# Altium schematic sheet 16-channel-EEG-SCH.SchDoc: 16 CHANNEL EEG MONITOR
size 431 x 279 mm; ApprovedBy: NA; CheckedBy: NA; Author: ANDY NGUYEN; CompanyName: NA; DrawnBy: ANDY NGUYEN; Engineer: ANDY NGUYEN; Organization: NA; DocumentNumber: NA; Revision: 1; Title2: NA; ENG_APP_DATE: --/--/--; DSN_APP_DATE: --/--/--; CHK_APP_DATE: --/--/--
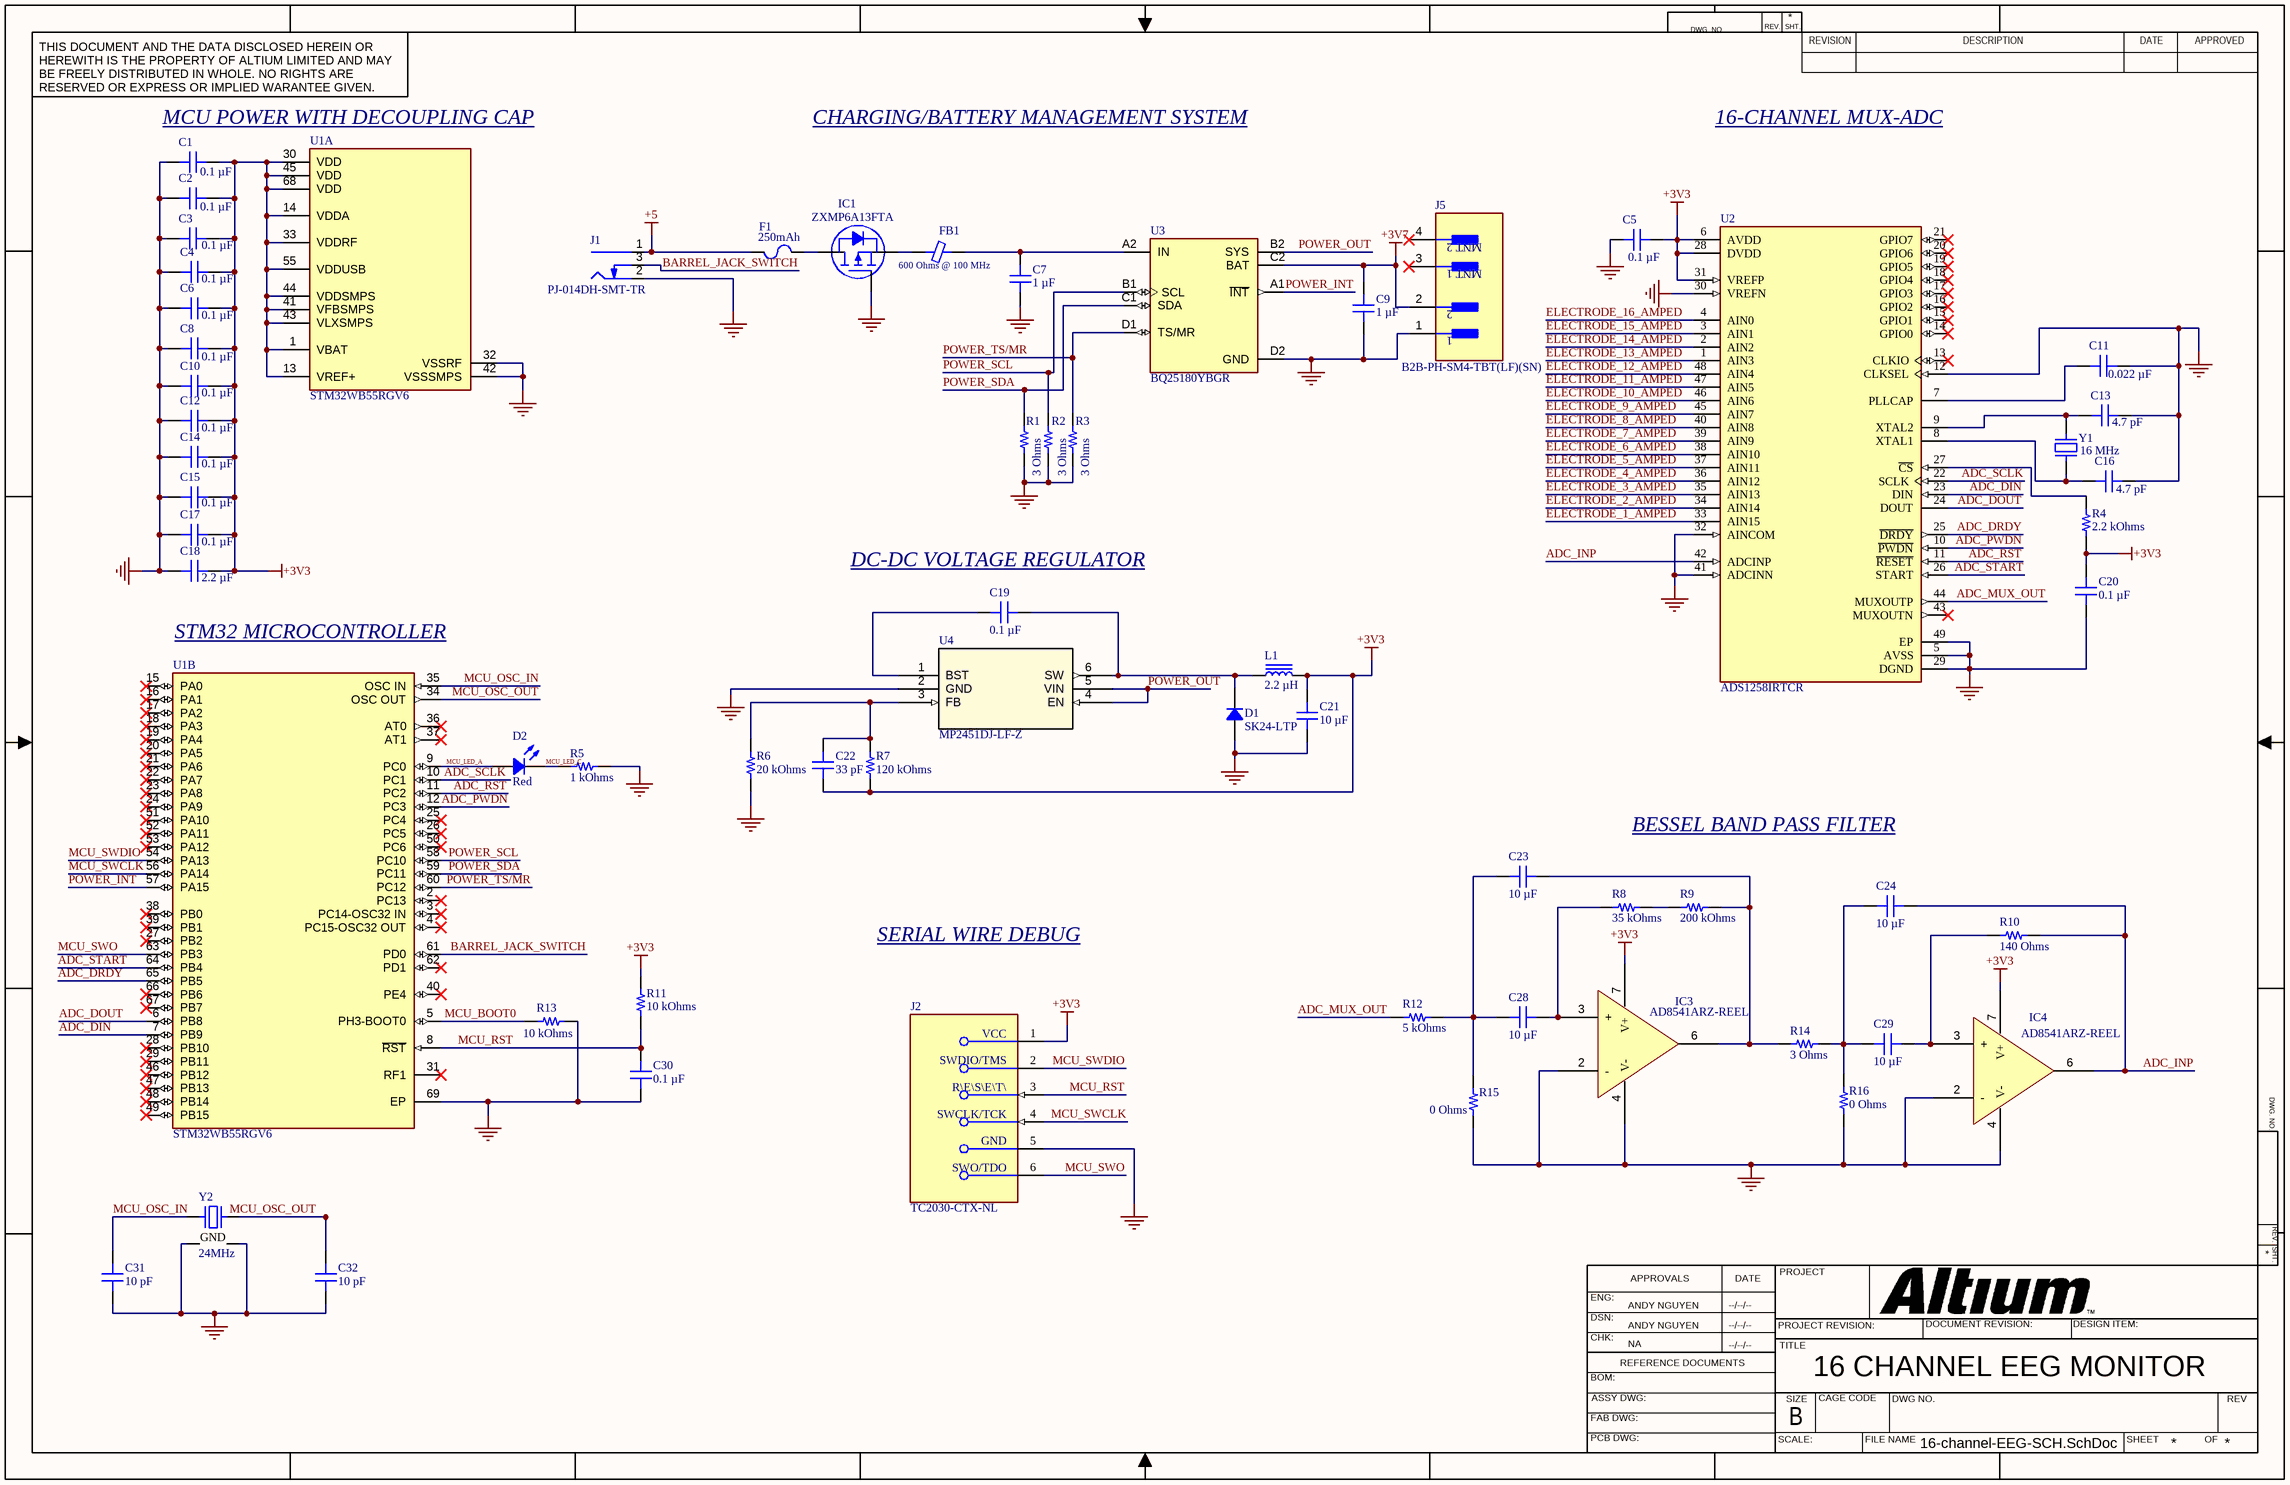
[diagram p0: 16-channel-EEG-SCH.SchDoc]

## Parts
C1  0.1 µF  [CAP 0402_1005]
C2  0.1 µF  [CAP 0402_1005]
C3  0.1 µF  [CAP 0402_1005]
C4  0.1 µF  [CAP 0402_1005]
C5  0.1 µF  [CAP 0402_1005]
C6  0.1 µF  [CAP 0402_1005]
C7  1 µF  [CAP 0402_1005]
C8  0.1 µF  [CAP 0402_1005]
C9  1 µF  [CAP 0402_1005]
C10  0.1 µF  [CAP 0402_1005]
C11  0.022 µF  [CAP 0402_1005]
C12  0.1 µF  [CAP 0402_1005]
C13  4.7 pF  [CAP 0402_1005]
C14  0.1 µF  [CAP 0402_1005]
C15  0.1 µF  [CAP 0402_1005]
C16  4.7 pF  [CAP 0402_1005]
C17  0.1 µF  [CAP 0402_1005]
C18  2.2 µF  [CAP 0603_1608]
C19  0.1 µF  [CAP 0402_1005]
C20  0.1 µF  [CAP 0402_1005]
C21  10 µF  [CAP 0402_1005]
C22  33 pF  [CAP 0402_1005]
C23  10 µF  [CAP 0402_1005]
C24  10 µF  [CAP 0402_1005]
C28  10 µF  [CAP 0402_1005]
C29  10 µF  [CAP 0402_1005]
C30  0.1 µF  [CAP 0402_1005]
C31  10 pF  [CAP 0402_1005]
C32  10 pF  [CAP 0402_1005]
D1  SK24-LTP  [DO214AA SMB]
D2  Red  [LED 1206_3216 RED]
F1  250mAh  [FUSE 1206_3216 0.6MM]
FB1  600 Ohms @ 100 MHz  [FER 0805_2012]
IC1  ZXMP6A13FTA  [DIODES SOT-23-3]
IC3  AD8541ARZ-REEL  [ANALOG DEV SOIC-8 R8]
IC4  AD8541ARZ-REEL  [ANALOG DEV SOIC-8 R8]
J1  PJ-014DH-SMT-TR  [CUI PJ-014DH-SMT]
J2  TC2030-CTX-NL  [FP-TC2030-CTX-NL-MFG]
J5  B2B-PH-SM4-TBT(LF)(SN)  [FP-B2B-PH-SM4-TBT_LF_SN-MFG]
L1  2.2 µH  [BOURNS SRP5030T]
R1  3 Ohms  [RES 0402_1005]
R2  3 Ohms  [RES 0402_1005]
R3  3 Ohms  [RES 0402_1005]
R4  2.2 kOhms  [RES 0402_1005]
R5  1 kOhms  [RES 0402_1005]
R6  20 kOhms  [RES 0402_1005]
R7  120 kOhms  [RES 0402_1005]
R8  35 kOhms  [RES 0402_1005]
R9  200 kOhms  [RES 0402_1005]
R10  140 Ohms  [RES 0402_1005]
R11  10 kOhms  [RES 0402_1005]
R12  5 kOhms  [RES 0402_1005]
R13  10 kOhms  [RES 0402_1005]
R14  3 Ohms  [RES 0402_1005]
R15  0 Ohms  [RES 0402_1005]
R16  0 Ohms  [RES 0402_1005]
U1  STM32WB55RGV6  [FP-VFQFPN-68-B029-MFG]  (parts A,B of 2)
U2  ADS1258IRTCR  [FP-RTC0048A-IPC_C]
U3  BQ25180YBGR  [IC_BQ25180YBGR]
U4  MP2451DJ-LF-Z  [TSOT23-6_MP2451_MNP]
Y1  16 MHz  [ABRACON ABLS]
Y2  24MHz  [ABRACON ABM8G]

## Nets
+3V3: C1.1 C2.1 C3.1 C4.1 C5.2 C6.1 C8.1 C10.1 C12.1 C14.1 C15.1 C17.1 C18.1 C20.2 C21.2 C22.1 IC3.7(V+) IC4.7(V+) J2.1(VCC) L1.2 R4.1 R7.1 R11.2 U1.1(VBAT) U1.13(VREF+) U1.14(VDDA) U1.30(VDD) U1.33(VDDRF) U1.41(VFBSMPS) U1.43(VLXSMPS) U1.44(VDDSMPS) U1.45(VDD) U1.55(VDDUSB) U1.68(VDD) U2.6(AVDD) U2.28(DVDD) U2.31(VREFP)
+3V7: C9.2 J5.2 U3.C2(BAT)
+5: F1.1 J1.1(Centre)
GND: C1.2 C2.2 C3.2 C4.2 C5.1 C6.2 C7.1 C8.2 C9.1 C10.2 C11.2 C12.2 C13.2 C14.2 C15.2 C16.2 C17.2 C18.2 C20.1 C21.1 C30.1 C31.1 C32.1 D1.1 IC1.1(G) IC3.2(-) IC3.4(V-) IC4.2(-) IC4.4(V-) J1.2(Outer) J2.5(GND) J5.1 R1.1 R2.1 R3.1 R5.1 R6.1 R13.1 R15.1 R16.1 U1.32(VSSRF) U1.42(VSSSMPS) U1.69(EP) U2.5(AVSS) U2.12(CLKSEL) U2.29(DGND) U2.30(VREFN) U2.32(AINCOM) U2.41(ADCINN) U2.49(EP) U3.D2(GND) U4.2(GND) Y2.2(GND) Y2.4(GND)
ADC_DIN: U1.7(PB9) U2.23(DIN)
ADC_DOUT: U1.6(PB8) U2.24(DOUT)
ADC_DRDY: U1.65(PB5) U2.25(~{DRDY})
ADC_INP: C24.2 IC4.6(OUT) R10.2 U2.42(ADCINP)
ADC_MUX_OUT: R12.1 U2.44(MUXOUTP)
ADC_PWDN: U1.12(PC3) U2.10(~{PWDN})
ADC_RST: U1.11(PC2) U2.11(~{RESET})
ADC_SCLK: U1.10(PC1) U2.22(SCLK)
ADC_START: U1.64(PB4) U2.26(START)
BARREL_JACK_SWITCH: J1.3(SW) U1.61(PD0)
ELECTRODE_1_AMPED: U2.33(AIN15)
ELECTRODE_2_AMPED: U2.34(AIN14)
ELECTRODE_3_AMPED: U2.35(AIN13)
ELECTRODE_4_AMPED: U2.36(AIN12)
ELECTRODE_5_AMPED: U2.37(AIN11)
ELECTRODE_6_AMPED: U2.38(AIN10)
ELECTRODE_7_AMPED: U2.39(AIN9)
ELECTRODE_8_AMPED: U2.40(AIN8)
ELECTRODE_9_AMPED: U2.45(AIN7)
ELECTRODE_10_AMPED: U2.46(AIN6)
ELECTRODE_11_AMPED: U2.47(AIN5)
ELECTRODE_12_AMPED: U2.48(AIN4)
ELECTRODE_13_AMPED: U2.1(AIN3)
ELECTRODE_14_AMPED: U2.2(AIN2)
ELECTRODE_15_AMPED: U2.3(AIN1)
ELECTRODE_16_AMPED: U2.4(AIN0)
MCU_BOOT0: R13.2 U1.5(PH3-BOOT0)
MCU_LED_A: D2.1 U1.9(PC0)
MCU_LED_C: D2.2 R5.2
MCU_OSC_IN: C31.2 U1.35(OSC_IN) Y2.1
MCU_OSC_OUT: C32.2 U1.34(OSC_OUT) Y2.3
MCU_RST: C30.2 J2.3(~{RESET}) R11.1 U1.8(~{RST})
MCU_SWCLK: J2.4(SWCLK/TCK) U1.56(PA14)
MCU_SWDIO: J2.2(SWDIO/TMS) U1.54(PA13)
MCU_SWO: J2.6(SWO/TDO) U1.63(PB3)
POWER_INT: U1.57(PA15) U3.A1(~{INT})
POWER_OUT: U3.B2(SYS) U4.4(EN) U4.5(VIN)
POWER_SCL: R2.2 U1.58(PC10) U3.B1(SCL)
POWER_SDA: R1.2 U1.59(PC11) U3.C1(SDA)
POWER_TS/MR: R3.2 U1.60(PC12) U3.D1(TS/MR)
NetC7_2: C7.2 FB1.2 U3.A2(IN)
NetC11_1: C11.1 U2.7(PLLCAP)
NetC13_1: C13.1 U2.9(XTAL2) Y1.2
NetC16_1: C16.1 U2.8(XTAL1) Y1.1
NetC19_1: C19.1 U4.1(BST)
NetC19_2: C19.2 D1.2 L1.1 U4.6(SW)
NetC22_2: C22.2 R6.2 R7.2 U4.3(FB)
NetC23_1: C23.1 C28.1 R12.2 R15.2
NetC23_2: C23.2 IC3.6(OUT) R9.2 R14.1
NetC24_1: C24.1 C29.1 R14.2 R16.2
NetC28_2: C28.2 IC3.3(+) R8.1
NetC29_2: C29.2 IC4.3(+) R10.1
NetF1_2: F1.2 IC1.3(D)
NetFB1_1: FB1.1 IC1.2(S)
NetR4_2: R4.2 U2.27(~{CS})
NetR8_2: R8.2 R9.1

Not connected (* = marked no-connect by the designer): J5 3(MNT_1)* 4(MNT_2)*; U1 2(PC13)* 3(PC14-OSC32_IN)* 4(PC15-OSC32_OUT)* 15(PA0)* 16(PA1)* 17(PA2)* 18(PA3)* 19(PA4)* 20(PA5)* 21(PA6)* 22(PA7)* 23(PA8)* 24(PA9)* 25(PC4)* 26(PC5)* 27(PB2)* 28(PB10)* 29(PB11)* 31(RF1)* 36(AT0)* 37(AT1)* 38(PB0)* 39(PB1)* 40(PE4)* 46(PB12)* 47(PB13)* 48(PB14)* 49(PB15)* 50(PC6)* 51(PA10)* 52(PA11)* 53(PA12)* 62(PD1)* 66(PB6)* 67(PB7)*; U2 13(CLKIO)* 14(GPIO0)* 15(GPIO1)* 16(GPIO2)* 17(GPIO3)* 18(GPIO4)* 19(GPIO5)* 20(GPIO6)* 21(GPIO7)* 43(MUXOUTN)*

## Notes on the sheet
- MCU POWER WITH DECOUPLING CAP
- CHARGING/BATTERY MANAGEMENT SYSTEM
- 16-CHANNEL MUX-ADC
- (near C19) DC-DC VOLTAGE REGULATOR
- STM32 MICROCONTROLLER
- BESSEL BAND PASS FILTER
- SERIAL WIRE DEBUG
- DWG. NO.
- REV.
- SHT.
- THIS DOCUMENT AND THE DATA DISCLOSED HEREIN OR HEREWITH IS THE PROPERTY OF ALTIUM LIMITED AND MAY BE FREELY DISTRIBUTED IN WHOLE. NO RIGHTS ARE RESERVED OR EXPRESS OR IMPLIED WARANTEE GIVEN.
- REVISION
- DESCRIPTION
- DATE
- APPROVED
- ENG:
- APPROVALS
- PROJECT
- DSN:
- CHK:
- REFERENCE DOCUMENTS
- PROJECT REVISION:
- TITLE
- DOCUMENT REVISION:
- DESIGN ITEM:
- BOM:
- FAB DWG:
- PCB DWG:
- ASSY DWG:
- SCALE:
- SIZE
- B
- CAGE CODE
- FILE NAME
- DWG NO.
- SHEET
- OF
- REV

## Library data of the parts
C1-C6 C8 C10 C12 C14 C15 C17 C20 = C0402C104K4RECAUTO: CAP CER 0402 0.1UF 16V X7R 10%; manufacturer: KEMET; Part Number: C0402C104K4RECAUTO; Value: 0.1 µF; Applications: Automotive, ESD Protection; Capacitance: 0.1 µF; componentlink1description: Datasheet; componentlink1url: https://api.kemet.com/component-edge/download/datasheet/C0402C104K4RECAUTO.pdf; componentlink2description: DigiKey Link; componentlink2url: https://www.digikey.com/en/products/detail/kemet/C0402C104K4RECAUTO/8563695; Device Package: 0402 (1005 Metric); lastupdated: 1/28/2024 8:04:20 PM; Lifecycle Status: Active; Minimum Order: 1; Mounting Type: Surface Mount, MLCC; Operating Temperature: -55°C ~ 125°C; Package / Case: 0402 (1005 Metric); packaging: TapeAndReel; partid: 1731; Part Status: Active; price: 0.01; Ratings: AEC-Q200; series: ESD SMD Auto X7R; Size / Dimension: 0.039" L x 0.020" W (1.00mm x 0.50mm); Supplier 1: DigiKey; Supplier Part Number 1: 399-17167-1-ND; Temperature Coefficient: X7R; Thickness (Max): 0.022" (0.55mm); Tolerance: ±10%; Voltage - Rated: 16V
C7 C9 = GRM155R6YA105KE11D: CAP CER 1UF 35V X5R 0402; manufacturer: Murata Electronics; Tolerance: ±10%; Part Number: GRM155R6YA105KE11D; Value: 1 µF; Applications: General Purpose; Capacitance: 1 µF; componentlink1description: Datasheet; componentlink1url: https://search.murata.co.jp/Ceramy/image/img/A01X/G101/ENG/GRM155R6YA105KE11-01.pdf; componentlink2description: DigiKey Link; componentlink2url: https://www.digikey.com/en/products/detail/murata-electronics/GRM155R6YA105KE11D/4905162; Device Package: 0402 (1005 Metric); lastupdated: 1/29/2024 8:04:22 PM; Lifecycle Status: Active; Minimum Order: 1; Mounting Type: Surface Mount, MLCC; Operating Temperature: -55°C ~ 85°C; Package / Case: 0402 (1005 Metric); packaging: TapeAndReel; partid: 4167; Part Status: Active; price: 0.01; series: GRM; Size / Dimension: 0.039" L x 0.020" W (1.00mm x 0.50mm); Supplier 1: DigiKey; Supplier Part Number 1: 490-10019-1-ND; Temperature Coefficient: X5R; Thickness (Max): 0.024" (0.60mm); Voltage - Rated: 35V
C11 = C0402C223K4RECAUTO: CAP CER 0402 22NF 16V X7R 10%; manufacturer: KEMET; Part Number: C0402C223K4RECAUTO; Value: 0.022 µF; Applications: Automotive, ESD Protection; Capacitance: 0.022 µF; componentlink1description: Datasheet; componentlink1url: https://api.kemet.com/component-edge/download/datasheet/C0402C223K4RECAUTO.pdf; componentlink2description: DigiKey Link; componentlink2url: https://www.digikey.com/en/products/detail/kemet/C0402C223K4RECAUTO/8640471; Device Package: 0402 (1005 Metric); lastupdated: 1/29/2024 8:04:09 PM; Lifecycle Status: Active; Minimum Order: 1; Mounting Type: Surface Mount, MLCC; Operating Temperature: -55°C ~ 125°C; Package / Case: 0402 (1005 Metric); packaging: TapeAndReel; partid: 12106; Part Status: Active; price: 0.01; Ratings: AEC-Q200; series: ESD SMD Auto X7R; Size / Dimension: 0.039" L x 0.020" W (1.00mm x 0.50mm); Supplier 1: DigiKey; Supplier Part Number 1: 399-17877-1-ND; Temperature Coefficient: X7R; Thickness (Max): 0.022" (0.55mm); Tolerance: ±10%; Voltage - Rated: 16V
C13 C16 = 885012005023: CAP CER 4.7PF 16V C0G/NP0 0402; manufacturer: Würth Elektronik; Temperature Coefficient: C0G, NP0; Tolerance: ±0.5pF; Part Number: 885012005023; Value: 4.7 pF; Applications: General Purpose; Capacitance: 4.7 pF; componentlink1description: Datasheet; componentlink1url: https://katalog.we-online.de/pbs/datasheet/885012005023.pdf; componentlink2description: DigiKey Link; componentlink2url: https://www.digikey.com/en/products/detail/würth-elektronik/885012005023/5453294; Device Package: 0402 (1005 Metric); lastupdated: 1/29/2024 8:04:26 PM; Lifecycle Status: Active; Minimum Order: 1; Mounting Type: Surface Mount, MLCC; Operating Temperature: -55°C ~ 125°C; Package / Case: 0402 (1005 Metric); packaging: TapeAndReel; partid: 2042; Part Status: Active; price: 0.01; series: WCAP-CSGP; Size / Dimension: 0.039" L x 0.020" W (1.00mm x 0.50mm); Supplier 1: DigiKey; Supplier Part Number 1: 732-7439-1-ND; Thickness (Max): 0.022" (0.55mm); Voltage - Rated: 16V
C18 = CC0603ZRY5V7BB225: CAP CER 2.2UF 16V Y5V 0603; manufacturer: Yageo; Temperature Coefficient: Y5V (F); Tolerance: -20%, +80%; Part Number: CC0603ZRY5V7BB225; Value: 2.2 µF; Applications: General Purpose; Capacitance: 2.2 µF; componentlink1description: Datasheet; componentlink1url: http://www.yageo.com/documents/recent/UPY-GPHC_Y5V_6.3V-to-50V_8.pdf; componentlink2description: DigiKey Link; componentlink2url: https://www.digikey.com/en/products/detail/yageo/CC0603ZRY5V7BB225/5883851; Device Package: 0603 (1608 Metric); lastupdated: 1/28/2024 8:09:58 PM; Lifecycle Status: Active; Minimum Order: 1; Mounting Type: Surface Mount, MLCC; Operating Temperature: -30°C ~ 85°C; Package / Case: 0603 (1608 Metric); packaging: TapeAndReel; partid: 2203; Part Status: Active; price: 0.01; series: CC; Size / Dimension: 0.063" L x 0.031" W (1.60mm x 0.80mm); Supplier 1: DigiKey; Supplier Part Number 1: 311-3416-1-ND; Thickness (Max): 0.035" (0.90mm); Voltage - Rated: 16V
C19 = GRM155R62A104ME14D: CAP CER 0.1UF 100V X5R 0402; manufacturer: Murata Electronics; Tolerance: ±20%; Part Number: GRM155R62A104ME14D; Value: 0.1 µF; Applications: General Purpose; Capacitance: 0.1 µF; componentlink1description: Datasheet; componentlink1url: https://search.murata.co.jp/Ceramy/image/img/A01X/G101/ENG/GRM155R62A104ME14-01.pdf; componentlink2description: DigiKey Link; componentlink2url: https://www.digikey.com/en/products/detail/murata-electronics/GRM155R62A104ME14D/5027544; Device Package: 0402 (1005 Metric); lastupdated: 1/29/2024 8:04:24 PM; Lifecycle Status: Active; Minimum Order: 1; Mounting Type: Surface Mount, MLCC; Operating Temperature: -55°C ~ 85°C; Package / Case: 0402 (1005 Metric); packaging: CutTape; partid: 2773; Part Status: Active; price: 0.01; series: GRM; Size / Dimension: 0.039" L x 0.020" W (1.00mm x 0.50mm); Supplier 1: DigiKey; Supplier Part Number 1: 490-10459-1-ND; Temperature Coefficient: X5R; Thickness (Max): 0.022" (0.55mm); Voltage - Rated: 100V
C21 C23 C24 C28 C29 = CL05A106MP5NUNC: CAP CER 10UF 10V X5R 0402; manufacturer: Samsung Electro-Mechanics; Tolerance: ±20%; Part Number: CL05A106MP5NUNC; Value: 10 µF; Applications: General Purpose; Capacitance: 10 µF; componentlink1description: Datasheet; componentlink1url: http://www.samsungsem.com/kr/support/product-search/mlcc/CL05A106MP5NUNC.jsp; componentlink2description: DigiKey Link; componentlink2url: https://www.digikey.com/en/products/detail/samsung-electro-mechanics/CL05A106MP5NUNC/3887108; Device Package: 0402 (1005 Metric); lastupdated: 1/29/2024 8:04:27 PM; Lifecycle Status: Active; Minimum Order: 1; Mounting Type: Surface Mount, MLCC; Operating Temperature: -55°C ~ 85°C; Package / Case: 0402 (1005 Metric); packaging: TapeAndReel; partid: 1762; Part Status: Active; price: 0.02; series: CL; Size / Dimension: 0.039" L x 0.020" W (1.00mm x 0.50mm); Supplier 1: DigiKey; Supplier Part Number 1: 1276-1450-1-ND; Temperature Coefficient: X5R; Thickness (Max): 0.028" (0.70mm); Voltage - Rated: 10V
C22 = UMK105CH330JVHF: CAP CER 33PF 50V CH 0402; manufacturer: Taiyo Yuden; Tolerance: ±5%; Part Number: UMK105CH330JVHF; Value: 33 pF; Applications: Automotive; Capacitance: 33 pF; componentlink2description: DigiKey Link; componentlink2url: https://www.digikey.com/en/products/detail/taiyo-yuden/UMK105CH330JVHF/6563672; Device Package: 0402 (1005 Metric); lastupdated: 1/29/2024 8:04:26 PM; Lifecycle Status: Active; Minimum Order: 1; Mounting Type: Surface Mount, MLCC; Package / Case: 0402 (1005 Metric); packaging: TapeAndReel; partid: 1883; Part Status: Active; price: 0.01; Ratings: AEC-Q200; series: M; Size / Dimension: 0.039" L x 0.020" W (1.00mm x 0.50mm); Supplier 1: DigiKey; Supplier Part Number 1: 587-5079-1-ND; Temperature Coefficient: CH; Voltage - Rated: 50V
C30 = CL05B104KP5VPNC: CAP CER 100NF 10V X7R 0402; manufacturer: Samsung Electro-Mechanics; Tolerance: ±10%; Part Number: CL05B104KP5VPNC; Value: 0.1 µF; Applications: Automotive; Capacitance: 0.1 µF; componentlink1description: Datasheet; componentlink1url: https://mm.digikey.com/Volume0/opasdata/d220001/medias/docus/5458/CL05B104KP5VPNC_Spec.pdf; componentlink2description: DigiKey Link; componentlink2url: https://www.digikey.com/en/products/detail/samsung-electro-mechanics/CL05B104KP5VPNC/20498482; Device Package: 0402 (1005 Metric); lastupdated: 1/25/2024 8:03:07 PM; Lifecycle Status: Active; Minimum Order: 1; Mounting Type: Surface Mount, MLCC; Operating Temperature: -55°C ~ 125°C; Package / Case: 0402 (1005 Metric); packaging: TapeAndReel; partid: 56690; price: 0.01; Ratings: AEC-Q200; series: CL; Size / Dimension: 0.039" L x 0.020" W (1.00mm x 0.50mm); Supplier 1: DigiKey; Supplier Part Number 1: 1276-CL05B104KP5VPNCCT-ND; Temperature Coefficient: X7R; Thickness (Max): 0.022" (0.55mm); Voltage - Rated: 10V
C31 C32 = 885012005025: CAP CER 10PF 16V C0G/NP0 0402; manufacturer: Würth Elektronik; Temperature Coefficient: C0G, NP0; Tolerance: ±5%; Part Number: 885012005025; Value: 10 pF; Applications: General Purpose; Capacitance: 10 pF; componentlink1description: Datasheet; componentlink1url: https://katalog.we-online.de/pbs/datasheet/885012005025.pdf; componentlink2description: DigiKey Link; componentlink2url: https://www.digikey.com/en/products/detail/würth-elektronik/885012005025/5453296; Device Package: 0402 (1005 Metric); lastupdated: 1/25/2024 8:04:27 PM; Lifecycle Status: Active; Minimum Order: 1; Mounting Type: Surface Mount, MLCC; Operating Temperature: -55°C ~ 125°C; Package / Case: 0402 (1005 Metric); packaging: TapeAndReel; partid: 1972; Part Status: Active; price: 0.01; series: WCAP-CSGP; Size / Dimension: 0.039" L x 0.020" W (1.00mm x 0.50mm); Supplier 1: DigiKey; Supplier Part Number 1: 732-7441-1-ND; Thickness (Max): 0.022" (0.55mm); Voltage - Rated: 16V
D1 = SK24-LTP: DIODE SCHOT 40V 2A DO214AA HSMB; Manufacturer: Micro Commercial Co; Capacitance @ Vr, F: 50pF @ 4V, 1MHz; Current - Reverse Leakage @ Vr: 2 mA @ 40 V; Diode Type: Schottky; Speed: Fast Recovery =< 500ns, > 200mA (Io); Voltage - Forward (Vf) (Max) @ If: 500 mV @ 2 A; Part Number: SK24-LTP; ComponentLink1Description: Datasheet; ComponentLink1URL: https://www.mccsemi.com/pdf/Products/SK22-L~SK220-L(DO-214AA).pdf; ComponentLink2Description: DigiKey Link; ComponentLink2URL: https://www.digikey.com/en/products/detail/micro-commercial-co/SK24-LTP/3774982; Current - Average Rectified (Io): 2A; LastUpdated: 9/24/2023 8:18:33 PM; Lifecycle Status: Active; Minimum Order: 1; Mounting Type: Surface Mount; Operating Temperature - Junction: -55°C ~ 125°C; Package / Case: DO-214AA, SMB; Packaging: TapeAndReel; PartId: 1499; Part Status: Active; Price: 0.04; Series: -; Supplier 1: DigiKey; Supplier Part Number 1: SK24-LTPMSCT-ND; Supplier Device Package: DO-214AA, HSMB; Voltage - DC Reverse (Vr) (Max): 40 V
D2 = APTR3216SECK/J3-PRV: LED SMD; Manufacturer: Kingbright; Configuration: 1206; Current - Test: 20mA; Lens Color: Colorless; Lens Size: 1.60mm x 1.40mm; Lens Style: Rectangle with Flat Top; Lens Transparency: Clear; Millicandela Rating: 350mcd; Viewing Angle: 140°; Voltage - Forward (Vf) (Typ): 2.2V; Wavelength - Dominant: 625nm; Wavelength - Peak: 640nm; Part Number: APTR3216SECK/J3-PRV; Color: Red; ComponentLink1Description: Datasheet; ComponentLink1URL: http://www.kingbrightusa.com/images/catalog/SPEC/APTR3216SECK-J3-PRV.pdf; ComponentLink2Description: DigiKey Link; ComponentLink2URL: https://www.digikey.com/en/products/detail/kingbright/APTR3216SECK-J3-PRV/10293085; Device Package: 1206 (3216 Metric); Height (Max): 1.25mm; LastUpdated: 1/26/2024 9:29:21 PM; Lifecycle Status: Active; Minimum Order: 1; Mounting Type: Surface Mount; Package / Case: 1206 (3216 Metric); Packaging: TapeAndReel; PartId: 194; Part Status: Active; Price: 0.17; Series: Heli-R; Size / Dimension: 3.20mm L x 1.60mm W; Supplier 1: DigiKey; Supplier Part Number 1: 754-APTR3216SECK/J3-PRVCT-ND; Supplier Device Package: 1206; Value: Red
F1 = SF-1206FP050-2: FUSE BOARD MNT 500MA 63VDC 1206; Manufacturer: Bourns Inc.; Approval Agency: UL; Breaking Capacity @ Rated Voltage: 50A; Fuse Type: Board Mount (Cartridge Style Excluded); Melting I²t: 0.015; Response Time: Fast Blow; Voltage Rating - DC: 63V; Part Number: SF-1206FP050-2; Approvals: UL; ComponentLink1Description: Datasheet; ComponentLink1URL: https://www.bourns.com/docs/product-datasheets/sf-1206fp.pdf; ComponentLink2Description: DigiKey Link; ComponentLink2URL: http://digikey.com/product-detail/en/bourns-inc/SF-1206FP050-2/SF-1206FP050-2CT-ND/7652265; Current Rating (Amps): 500mA; Device Package: 1206 (3216 Metric); LastUpdated: 9/2/2020 1:30:42 AM; Lifecycle Status: Active; Minimum Order: 1; Mounting Type: Surface Mount; Operating Temperature: -20°C ~ 105°C; Package / Case: 1206 (3216 Metric); Packaging: TapeAndReel; Part Status: Active; Price: 0.34; Series: SinglFuse™ SF-1206FP; Size / Dimension: 0.122" L x 0.061" W x 0.024" H (3.10mm x 1.55mm x 0.60mm); Supplier 1: DigiKey; Supplier Part Number 1: SF-1206FP050-2CT-ND
FB1 = BMB2A0600RS2: FERRITE BEAD 600 OHM 0805 1LN; Manufacturer: TE Connectivity Passive Product; Current Rating (Max): 200mA; DC Resistance (DCR) (Max): 500mOhm; Number of Lines: 1; Part Number: BMB2A0600RS2; ComponentLink1Description: Datasheet; ComponentLink1URL: https://www.te.com/commerce/DocumentDelivery/DDEController?Action=srchrtrv&DocNm=1773184&DocType=DS&DocLang=English; ComponentLink2Description: DigiKey Link; ComponentLink2URL: https://www.digikey.com/en/products/detail/te-connectivity-passive-product/BMB2A0600RS2/1152529; Device Package: 0805 (2012 Metric); Height (Max): 0.043" (1.10mm); Impedance @ Frequency: 600 Ohms @ 100 MHz; LastUpdated: 9/24/2023 8:16:58 PM; Lifecycle Status: Active; Minimum Order: 1; Mounting Type: Surface Mount; Operating Temperature: -55°C ~ 125°C; Package / Case: 0805 (2012 Metric); Packaging: TapeAndReel; PartId: 1506; Part Status: Active; Price: 0.10; Series: BMB-R; Size / Dimension: 0.079" L x 0.047" W (2.00mm x 1.20mm); Supplier 1: DigiKey; Supplier Part Number 1: A102078CT-ND; Value: 600 Ohms @ 100 MHz
IC1 = ZXMP6A13FTA: MOSFET P-CH 60V 900MA SOT23-3; Manufacturer: Diodes Incorporated; Current - Continuous Drain (Id) @ 25°C: 900mA (Ta); Drive Voltage (Max Rds On,  Min Rds On): 4.5V, 10V; FET Type: P-Channel; Gate Charge (Qg) (Max) @ Vgs: 5.9 nC @ 10 V; Input Capacitance (Ciss) (Max) @ Vds: 219 pF @ 30 V; Power Dissipation (Max): 625mW (Ta); Rds On (Max) @ Id, Vgs: 400mOhm @ 900mA, 10V; Vgs (Max): ±20V; Vgs(th) (Max) @ Id: 3V @ 250µA; Part Number: ZXMP6A13FTA; ComponentLink1Description: Datasheet; ComponentLink1URL: https://www.diodes.com/assets/Datasheets/ZXMP6A13F.pdf; ComponentLink2Description: DigiKey Link; ComponentLink2URL: https://www.digikey.com/en/products/detail/diodes-incorporated/ZXMP6A13FTA/560639; Drain to Source Voltage (Vdss): 60 V; LastUpdated: 9/24/2023 8:37:44 PM; Lifecycle Status: Active; Minimum Order: 1; Mounting Type: Surface Mount; Operating Temperature: -55°C ~ 150°C (TJ); Package / Case: TO-236-3, SC-59, SOT-23-3; Packaging: TapeAndReel; Part Status: Active; Price: 0.16; Series: -; Supplier 1: DigiKey; Supplier Part Number 1: ZXMP6A13FCT-ND; Supplier Device Package: SOT-23-3; Technology: MOSFET (Metal Oxide)
IC3 IC4 = AD8541ARZ-REEL: IC OPAMP GP 1 CIRCUIT 8SOIC; Manufacturer: Analog Devices Inc.; Amplifier Type: General Purpose; Current - Input Bias: 4pA; Current - Output / Channel: 30mA; Current - Supply: 45µA; Gain Bandwidth Product: 1MHz; Number of Circuits: 1; Output Type: Rail-to-Rail; Slew Rate: 0.92V/µs; Voltage - Input Offset: 1mV; Voltage - Supply, Single/Dual (±): 2.7V ~ 5.5V; Part Number: AD8541ARZ-REEL; ComponentLink1Description: Datasheet; ComponentLink1URL: https://www.analog.com/media/en/technical-documentation/data-sheets/AD8541_8542_8544.pdf; ComponentLink2Description: DigiKey Link; ComponentLink2URL: http://digikey.com/product-detail/en/analog-devices-inc/AD8541ARZ-REEL/AD8541ARZ-REELCT-ND/4907211; Device Package: 8-SOIC (0.154", 3.90mm Width); LastUpdated: 1/9/2020 12:52:28 AM; Lifecycle Status: Active; Minimum Order: 1; Mounting Type: Surface Mount; Operating Temperature: -40°C ~ 125°C; Package / Case: 8-SOIC (0.154", 3.90mm Width); Packaging: ReReel; PartId: 10; Part Status: Active; Price: 0.00; Series: -; Supplier 1: DigiKey; Supplier Part Number 1: AD8541ARZ-REELCT-ND; Supplier Device Package: 8-SOIC
J1 = PJ-014DH-SMT-TR: CONN PWR JACK 1.3X3.4MM SOLDER; Manufacturer: CUI Devices; Actual Diameter: 0.051" (1.30mm ID), 0.154" (3.90mm OD); Current Rating (Amps): 3.5A; Gender: Male; Industry Recognized Mating Diameter: 1.30mm ID (0.051"), 3.50mm OD (0.138"); Internal Switch(s): Single Switch, Normally Closed; Material Flammability Rating: UL94 V-0; Mating Length/Depth: 0.244" (6.20mm); Number of Positions/Contacts: 2 Conductors, 3 Contacts; Shielding: Unshielded; Voltage - Rated: 24VDC; Part Number: PJ-014DH-SMT-TR; ComponentLink1Description: Datasheet; ComponentLink1URL: https://www.cuidevices.com/product/resource/digikeypdf/pj-014dh-smt-tr.pdf; ComponentLink2Description: DigiKey Link; ComponentLink2URL: //digikey.com/product-detail/en/cui-devices/PJ-014DH-SMT-TR/CP-014DHPJTR-ND/408462; Connector Type: Jack; Features: Board Guide; LastUpdated: 12/16/2019 6:55:19 PM; Lifecycle Status: 0; Minimum Order: 1; Mounting Type: Surface Mount, Right Angle; Packaging: TapeAndReel; Part Status: Active; Price: 0.56; Series: -; Supplier 1: DigiKey; Supplier Part Number 1: CP-014DHPJTR-ND; Termination: Solder
J2 = CMP-205963-000001-1: 6-Pin “No legs” TC2030 Plug-of-Nails™ Cable for use with ARM Cortex processors
J5 = CMP-17439-000005-1: CONN HEADER SMD 2POS 2MM; Manufacturer: JST; Current Rating: 2A; Conn Gender: Male; Voltage Rating: 100V; Description: Connector Header Surface Mount 2 position 0.079" (2.00mm); Conn Orientation: Vertical; Number Of Contacts: 2; Octopart: https://octopart.com/b2b-ph-sm4-tbt%28lf%29%28sn%29-jst-7877930; Number Of Rows: 1; Device Class L2: Headers and Wire Housings; RoHS: TRUE; Contact Material: Tin,Copper; Height: 6.65mm; Temperature: -25°C to +85°C; Temperature Range Low: -25°C; ComponentLink2Description: Datasheet; Manufacturer Part Number: B2B-PH-SM4-TBT(LF)(SN); ComponentLink2URL: http://www.jst-mfg.com/product/pdf/eng/ePH.pdf; Automotive: No; Pitch: 2mm; Lead Free: Yes; Device Class L3: unset; Category: Conn; Digikey Description: CONN HEADER SMD 2POS 2MM; Temperature Range High: +85°C; Package: 0; Device Class L1: Connectors
L1 = SRP5030T-2R2M: FIXED IND 2.2UH 5.5A 35 MOHM SMD; Manufacturer: Bourns Inc.; Current - Saturation: 9A; DC Resistance (DCR): 35mOhm Max; Inductance Frequency - Test: 100 kHz; Material - Core: Iron Powder; Shielding: Shielded; Tolerance: ±20%; Type: Drum Core, Wirewound; Part Number: SRP5030T-2R2M; ComponentLink1Description: Datasheet; ComponentLink1URL: https://www.bourns.com/docs/Product-Datasheets/SRP5030T.pdf; ComponentLink2Description: DigiKey Link; ComponentLink2URL: https://www.digikey.com/en/products/detail/bourns-inc/SRP5030T-2R2M/3986082; Current Rating (Amps): 5.5 A; Device Package: Nonstandard; Height - Seated (Max): 0.118" (3.00mm); Inductance: 2.2 µH; LastUpdated: 1/29/2024 9:33:25 PM; Lifecycle Status: Active; Minimum Order: 1; Mounting Type: Surface Mount; Operating Temperature: -40°C ~ 125°C; Package / Case: Nonstandard; Packaging: TapeAndReel; PartId: 7; Part Status: Active; Price: 0.59; Series: SRP5030T; Size / Dimension: 0.224" L x 0.205" W (5.70mm x 5.20mm); Supplier 1: DigiKey; Supplier Part Number 1: SRP5030T-2R2MCT-ND; Value: 2.2 µH
R1-R3 R14 = ERJ-2GEJ3R0X: RES SMD 3 OHM 5% 1/10W 0402; Manufacturer: Panasonic Electronic Components; Power (Watts): 0.1W, 1/10W; Temperature Coefficient: -100/ +600ppm/°C; Part Number: ERJ-2GEJ3R0X; Value: 3 Ohms; ComponentLink1Description: Datasheet; ComponentLink1URL: https://b2b-api.panasonic.eu/file_stream/pids/fileversion/1242; ComponentLink2Description: DigiKey Link; ComponentLink2URL: https://www.digikey.com/en/products/detail/panasonic-electronic-components/ERJ-2GEJ3R0X/282081; Composition: Thick Film; Device Package: 0402 (1005 Metric); Features: Automotive AEC-Q200; Height - Seated (Max): 0.016" (0.40mm); LastUpdated: 1/29/2024 8:27:56 PM; Lifecycle Status: Active; Minimum Order: 1; Number of Terminations: 2; Operating Temperature: -55°C ~ 155°C; Package / Case: 0402 (1005 Metric); Packaging: CutTape; PartId: 3543; Part Status: Active; Price: 0.01; Ratings: AEC-Q200; Resistance: 3 Ohms; Series: ERJ-2G; Size / Dimension: 0.039" L x 0.020" W (1.00mm x 0.50mm); Supplier 1: DigiKey; Supplier Part Number 1: P3.0JCT-ND; Supplier Device Package: 0402; Tolerance: ±5%
R4 = TNPW04022K20BYEP: RES 2.2K OHM 0.1% 1/16W 0402; Manufacturer: Vishay Dale; Power (Watts): 0.063W, 1/16W; Temperature Coefficient: ±10ppm/°C; Part Number: TNPW04022K20BYEP; Value: 2.2 kOhms; ComponentLink1Description: Datasheet; ComponentLink1URL: http://www.vishay.com/docs/28758/tnpw_e3.pdf; ComponentLink2Description: DigiKey Link; ComponentLink2URL: https://www.digikey.com/en/products/detail/vishay-dale/TNPW04022K20BYEP/8636618; Composition: Thin Film; Device Package: 0402 (1005 Metric); Features: Anti-Sulfur, Automotive AEC-Q200, Moisture Resistant; Height - Seated (Max): 0.016" (0.40mm); LastUpdated: 1/26/2024 8:27:33 PM; Lifecycle Status: Active; Minimum Order: 1; Number of Terminations: 2; Operating Temperature: -55°C ~ 155°C; Package / Case: 0402 (1005 Metric); Packaging: TapeAndReel; PartId: 3077; Part Status: Active; Price: 0.25; Ratings: AEC-Q200; Resistance: 2.2 kOhms; Series: TNPW e3; Size / Dimension: 0.039" L x 0.020" W (1.00mm x 0.50mm); Supplier 1: DigiKey; Supplier Part Number 1: 541-9805-1-ND; Supplier Device Package: 0402; Tolerance: ±0.1%
R5 = AT0402BRD071KL: RES SMD 1K OHM 0.1% 1/16W 0402; Manufacturer: Yageo; Power (Watts): 0.063W, 1/16W; Temperature Coefficient: ±25ppm/°C; Part Number: AT0402BRD071KL; Value: 1 kOhms; ComponentLink1Description: Datasheet; ComponentLink1URL: http://www.yageo.com/documents/recent/PYu-AT_51_RoHS_L_5.pdf; ComponentLink2Description: DigiKey Link; ComponentLink2URL: https://www.digikey.com/en/products/detail/yageo/AT0402BRD071KL/5138607; Composition: Thin Film; Device Package: 0402 (1005 Metric); Features: Anti-Sulfur, Automotive AEC-Q200, Moisture Resistant; Height - Seated (Max): 0.014" (0.35mm); LastUpdated: 1/25/2024 8:27:25 PM; Lifecycle Status: Active; Minimum Order: 1; Number of Terminations: 2; Operating Temperature: -55°C ~ 155°C; Package / Case: 0402 (1005 Metric); Packaging: TapeAndReel; PartId: 2462; Part Status: Active; Price: 0.08; Ratings: AEC-Q200; Resistance: 1 kOhms; Series: AT; Size / Dimension: 0.039" L x 0.020" W (1.00mm x 0.50mm); Supplier 1: DigiKey; Supplier Part Number 1: YAG2088CT-ND; Supplier Device Package: 0402; Tolerance: ±0.1%
R6 = CPF0402B20KE: RES SMD 20K OHM 0.1% 1/16W 0402; Manufacturer: TE Connectivity Passive Product; Power (Watts): 0.063W, 1/16W; Temperature Coefficient: ±25ppm/°C; Part Number: CPF0402B20KE; Value: 20 kOhms; ComponentLink1Description: Datasheet; ComponentLink1URL: https://www.te.com/commerce/DocumentDelivery/DDEController?Action=srchrtrv&DocNm=1773200&DocType=DS&DocLang=English; ComponentLink2Description: DigiKey Link; ComponentLink2URL: https://www.digikey.com/en/products/detail/te-connectivity-passive-product/CPF0402B20KE/2381755; Composition: Thin Film; Device Package: 0402 (1005 Metric); Height - Seated (Max): 0.014" (0.35mm); LastUpdated: 1/29/2024 8:28:00 PM; Lifecycle Status: Active; Minimum Order: 1; Number of Terminations: 2; Operating Temperature: -55°C ~ 155°C; Package / Case: 0402 (1005 Metric); Packaging: TapeAndReel; PartId: 2476; Part Status: Active; Price: 0.10; Resistance: 20 kOhms; Series: CPF, Neohm; Size / Dimension: 0.039" L x 0.020" W (1.00mm x 0.50mm); Supplier 1: DigiKey; Supplier Part Number 1: A119914CT-ND; Supplier Device Package: 0402; Tolerance: ±0.1%
R7 = RC0402FR-07120KL: RES 120K OHM 1% 1/16W 0402; Manufacturer: Yageo; Power (Watts): 0.063W, 1/16W; Temperature Coefficient: ±100ppm/°C; Part Number: RC0402FR-07120KL; Value: 120 kOhms; ComponentLink1Description: Datasheet; ComponentLink1URL: https://www.yageo.com/upload/media/product/productsearch/datasheet/rchip/PYu-RC_Group_51_RoHS_L_10.pdf; ComponentLink2Description: DigiKey Link; ComponentLink2URL: https://www.digikey.com/en/products/detail/yageo/RC0402FR-07120KL/726534; Composition: Thick Film; Device Package: 0402 (1005 Metric); Features: Moisture Resistant; Height - Seated (Max): 0.016" (0.40mm); LastUpdated: 1/29/2024 8:27:59 PM; Lifecycle Status: Active; Minimum Order: 1; Number of Terminations: 2; Operating Temperature: -55°C ~ 155°C; Package / Case: 0402 (1005 Metric); Packaging: CutTape; PartId: 2770; Part Status: Active; Price: 0.01; Resistance: 120 kOhms; Series: RC_L; Size / Dimension: 0.039" L x 0.020" W (1.00mm x 0.50mm); Supplier 1: DigiKey; Supplier Part Number 1: 311-120KLRCT-ND; Supplier Device Package: 0402; Tolerance: ±1%
R8 = RC0402FR-0735KL: RES 35K OHM 1% 1/16W 0402; Manufacturer: Yageo; Power (Watts): 0.063W, 1/16W; Temperature Coefficient: ±100ppm/°C; Part Number: RC0402FR-0735KL; Value: 35 kOhms; ComponentLink1Description: Datasheet; ComponentLink1URL: https://www.yageo.com/upload/media/product/productsearch/datasheet/rchip/PYu-RC_Group_51_RoHS_L_11.pdf; ComponentLink2Description: DigiKey Link; ComponentLink2URL: https://www.digikey.com/en/products/detail/yageo/RC0402FR-0735KL/5917655; Composition: Thick Film; Device Package: 0402 (1005 Metric); Features: Moisture Resistant; Height - Seated (Max): 0.016" (0.40mm); LastUpdated: 1/29/2024 8:26:21 PM; Lifecycle Status: Active; Minimum Order: 1; Number of Terminations: 2; Operating Temperature: -55°C ~ 155°C; Package / Case: 0402 (1005 Metric); Packaging: CutTape; PartId: 64894; Part Status: Active; Price: 0.01; Resistance: 35 kOhms; Series: RC_L; Size / Dimension: 0.039" L x 0.020" W (1.00mm x 0.50mm); Supplier 1: DigiKey; Supplier Part Number 1: 13-RC0402FR-0735KLCT-ND; Supplier Device Package: 0402; Tolerance: ±1%
R9 = RP73PF1E200KBTD: RES 200K OHM 0.1% 1/10W 0402; Manufacturer: TE Connectivity Passive Product; Power (Watts): 0.1W, 1/10W; Temperature Coefficient: ±25ppm/°C; Part Number: RP73PF1E200KBTD; Value: 200 kOhms; ComponentLink1Description: Datasheet; ComponentLink1URL: https://www.te.com/commerce/DocumentDelivery/DDEController?Action=srchrtrv&DocNm=1773272&DocType=DS&DocLang=English; ComponentLink2Description: DigiKey Link; ComponentLink2URL: https://www.digikey.com/en/products/detail/te-connectivity-passive-product/RP73PF1E200KBTD/8261082; Composition: Thin Film; Device Package: 0402 (1005 Metric); Height - Seated (Max): 0.014" (0.35mm); LastUpdated: 1/29/2024 8:28:00 PM; Lifecycle Status: Active; Minimum Order: 1; Number of Terminations: 2; Operating Temperature: -55°C ~ 155°C; Package / Case: 0402 (1005 Metric); Packaging: TapeAndReel; PartId: 2427; Part Status: Active; Price: 0.08; Resistance: 200 kOhms; Series: RP73, Holsworthy; Size / Dimension: 0.039" L x 0.020" W (1.00mm x 0.50mm); Supplier 1: DigiKey; Supplier Part Number 1: A127540CT-ND; Supplier Device Package: 0402; Tolerance: ±0.1%
R10 = RT0402BRD07140RL: RES SMD 140 OHM 0.1% 1/16W 0402; Manufacturer: Yageo; Power (Watts): 0.063W, 1/16W; Temperature Coefficient: ±25ppm/°C; Part Number: RT0402BRD07140RL; Value: 140 Ohms; ComponentLink1Description: Datasheet; ComponentLink1URL: https://www.yageo.com/upload/media/product/productsearch/datasheet/rchip/PYu-RT_1-to-0.01_RoHS_L_11.pdf; ComponentLink2Description: DigiKey Link; ComponentLink2URL: https://www.digikey.com/en/products/detail/yageo/RT0402BRD07140RL/1069036; Composition: Thin Film; Device Package: 0402 (1005 Metric); Height - Seated (Max): 0.014" (0.35mm); LastUpdated: 1/29/2024 8:27:55 PM; Lifecycle Status: Active; Minimum Order: 1; Number of Terminations: 2; Operating Temperature: -55°C ~ 155°C; Package / Case: 0402 (1005 Metric); Packaging: TapeAndReel; PartId: 3995; Part Status: Active; Price: 0.04; Resistance: 140 Ohms; Series: RT; Size / Dimension: 0.039" L x 0.020" W (1.00mm x 0.50mm); Supplier 1: DigiKey; Supplier Part Number 1: YAG1358CT-ND; Supplier Device Package: 0402; Tolerance: ±0.1%
R11 R13 = RP73PF1E10KBTD: RES 10K OHM 0.1% 1/10W 0402; Manufacturer: TE Connectivity Passive Product; Power (Watts): 0.1W, 1/10W; Temperature Coefficient: ±25ppm/°C; Part Number: RP73PF1E10KBTD; Value: 10 kOhms; ComponentLink1Description: Datasheet; ComponentLink1URL: https://www.te.com/commerce/DocumentDelivery/DDEController?Action=srchrtrv&DocNm=1773272&DocType=DS&DocLang=English; ComponentLink2Description: DigiKey Link; ComponentLink2URL: https://www.digikey.com/en/products/detail/te-connectivity-passive-product/RP73PF1E10KBTD/8260957; Composition: Thin Film; Device Package: 0402 (1005 Metric); Height - Seated (Max): 0.014" (0.35mm); LastUpdated: 1/25/2024 8:27:25 PM; Lifecycle Status: Active; Minimum Order: 1; Number of Terminations: 2; Operating Temperature: -55°C ~ 155°C; Package / Case: 0402 (1005 Metric); Packaging: TapeAndReel; PartId: 2434; Part Status: Active; Price: 0.08; Resistance: 10 kOhms; Series: RP73, Holsworthy; Size / Dimension: 0.039" L x 0.020" W (1.00mm x 0.50mm); Supplier 1: DigiKey; Supplier Part Number 1: A127415CT-ND; Supplier Device Package: 0402; Tolerance: ±0.1%
R12 = RC0402FR-075KL: RES 5K OHM 1% 1/16W 0402; Manufacturer: Yageo; Power (Watts): 0.063W, 1/16W; Temperature Coefficient: ±100ppm/°C; Part Number: RC0402FR-075KL; Value: 5 kOhms; ComponentLink1Description: Datasheet; ComponentLink1URL: https://www.yageo.com/upload/media/product/productsearch/datasheet/rchip/PYu-RC_Group_51_RoHS_L_11.pdf; ComponentLink2Description: DigiKey Link; ComponentLink2URL: https://www.digikey.com/en/products/detail/yageo/RC0402FR-075KL/5917711; Composition: Thick Film; Device Package: 0402 (1005 Metric); Features: Moisture Resistant; Height - Seated (Max): 0.016" (0.40mm); LastUpdated: 1/29/2024 8:26:16 PM; Lifecycle Status: Active; Minimum Order: 1; Number of Terminations: 2; Operating Temperature: -55°C ~ 155°C; Package / Case: 0402 (1005 Metric); Packaging: CutTape; PartId: 67880; Part Status: Active; Price: 0.01; Resistance: 5 kOhms; Series: RC_L; Size / Dimension: 0.039" L x 0.020" W (1.00mm x 0.50mm); Supplier 1: DigiKey; Supplier Part Number 1: 13-RC0402FR-075KLCT-ND; Supplier Device Package: 0402; Tolerance: ±1%
R15 R16 = PA0402-R-070RL: RES 0 OHM JUMPER 1/16W 0402; Manufacturer: Yageo; Power (Watts): 0.1W, 1/10W; Temperature Coefficient: ±150ppm/°C; Part Number: PA0402-R-070RL; Value: 0 Ohms; ComponentLink1Description: Datasheet; ComponentLink1URL: http://www.yageo.com/NewPortal/_en/search/productDocs.jsp?YageoPartNumber=PA0402-R-070RL; ComponentLink2Description: DigiKey Link; ComponentLink2URL: https://www.digikey.com/en/products/detail/yageo/PA0402-R-070RL/8255971; Composition: Metal Element; Device Package: 0402 (1005 Metric); Features: Automotive AEC-Q200, Current Sense; Height - Seated (Max): 0.016" (0.40mm); LastUpdated: 1/29/2024 8:27:06 PM; Lifecycle Status: Active; Minimum Order: 1; Number of Terminations: 2; Operating Temperature: -55°C ~ 125°C; Package / Case: 0402 (1005 Metric); Packaging: TapeAndReel; PartId: 15512; Part Status: Active; Price: 0.20; Resistance: 0 Ohms; Series: PA; Size / Dimension: 0.039" L x 0.022" W (1.00mm x 0.55mm); Supplier 1: DigiKey; Supplier Part Number 1: YAG5756CT-ND; Supplier Device Package: 0402; Tolerance: Jumper
U1 = CMP-12160-000001-1: ULTRA-LOW-POWER DUAL CORE ARM CO; Manufacturer: STMicroelectronics; Max Junction Temp: +125°C; Bandwidth: 75MHz; Max Frequency: 2480MHz; Sensitivity: -96dBm; Number Of Adc Channels: 19; Receiving Current: 4.5-7.9mA; Interface: I2C,SPI,UART,USART,USB; Data Rate: 2Mbits/s; Number Of Gpio: 49; Min Supply Voltage: 1.71V; Max Power Dissipation: 425mW; Max Supply Voltage: 3.6V; Standoff Height: 0mm; Octopart: https://octopart.com/stm32wb55rgv6-stmicroelectronics-98750848; Category: IC; Digikey Description: ULTRA-LOW-POWER DUAL CORE ARM CO; Height: 1mm; Device Class L2: RF Semiconductors and Devices; Automotive: No; Ambient Temperature Range High: +105°C; ComponentLink2Description: Datasheet; Ambient Temperature Range Low: -40°C; Lead Free: Yes; Temperature Range Low: -40°C; Ipc Land Pattern Name: QFN40P800X800X90-68; Device Class L1: Integrated Circuits (ICs); Manufacturer Part Number: STM32WB55RGV6; Package: VFQFPN-68-B029; RoHS: TRUE; Temperature Range High: +125°C; ComponentLink2URL: https://www.st.com/resource/en/datasheet/stm32wb55rg.pdf; Temperature: -40°C to +125°C; Device Class L3: Transceivers; Mouser Description: MCU 32-Bit STM32WB55 ARM Cortex M4 RISC 1MB Flash 1.7V to 3.6V 68-Pin VFQFPN Tray
U2 = CMP-0003-00953-2: IC ADC 24BIT SIGMA-DELTA 48VQFN; Number of Inputs: 16; Power Dissipation: 42mW; Max Supply Voltage: 5.25V; Max Dual Supply Voltage: 2.65V; Differential Nonlinearity: 1LSB; Number of A/D Converters: 1; Sampling Rate: 125KS/s; Polarity: Bipolar; Max Power Dissipation: 62mW; Resolution: 24b; Interface: SPI; Dual Supply Voltage: 2.5V; Min Dual Supply Voltage: 2.15V; Min Supply Voltage: 4.75V; Number of Bits: 24; Min Supply Voltage (DC): 2.7V; Supply Type: Single; Operating Supply Voltage: 5V; Packaging: Tape and Reel; Case/Package: VQFN; Number of Pins: 48; Power Consumption: 42mW; Radiation Hardening: No; Conversion Rate: 125KS/s; Lead Free: Lead Free; Min Operating Temperature: -40°C; Max Supply Voltage (DC): 5.25V; Package Quantity: 2500; Number of Converters: 1; Contact Plating: Gold; Max Operating Temperature: 105°C; RoHS Compliant: Yes
U3 = BQ25180YBGR: 1-A Li-ion IÂ²C programmable charger with regulated power path in WCSP package; MF: Texas Instruments; MP: BQ25180YBGR; Value: *; Purchase-URL: https://pricing.snapeda.com/search/part/BQ25180YBGR/?ref=eda; Package: None; Price: None; Check_prices: https://www.snapeda.com/parts/BQ25180YBGR/Texas+Instruments/view-part/?ref=eda; SnapEDA_Link: https://www.snapeda.com/parts/BQ25180YBGR/Texas+Instruments/view-part/?ref=snap; Availability: In Stock
U4 = MP2451DJ-LF-Z: No Description Available; Mfr_Name: Monolithic Power Systems; Copyright: Copyright (C) 2024 Ultra Librarian. All rights reserved.; Manufacturer_Part_Number: MP2451DJ-LF-Z; Digi-Key_Part_Number_1: 1589-1893-2-ND; Digi-Key_Part_Number_2: 1589-1893-1-ND; Digi-Key_Part_Number_3: 1589-1893-6-ND; RefDes: RefDes; Type: DEV
Y1 = ABLS-16.000MHZ-B2-T: CRYSTAL 16.0000MHZ 18PF SMD; Manufacturer: Abracon LLC; ESR (Equivalent Series Resistance): 40 Ohms; Frequency Stability: ±50ppm; Frequency Tolerance: ±20ppm; Operating Mode: Fundamental; Part Number: ABLS-16.000MHZ-B2-T; ComponentLink1Description: Datasheet; ComponentLink1URL: https://abracon.com/Resonators/abls.pdf; ComponentLink2Description: DigiKey Link; ComponentLink2URL: https://www.digikey.com/en/products/detail/abracon-llc/ABLS-16-000MHZ-B2-T/675266; Frequency: 16 MHz; Height - Seated (Max): 0.165" (4.20mm); LastUpdated: 1/29/2024 9:32:47 PM; Lifecycle Status: Active; Load Capacitance: 18pF; Minimum Order: 1; Mounting Type: Surface Mount; Operating Temperature: -20°C ~ 70°C; Package / Case: HC-49/US; Packaging: TapeAndReel; PartId: 132; Part Status: Active; Price: 0.12; Series: ABLS; Size / Dimension: 0.449" L x 0.185" W (11.40mm x 4.70mm); Supplier 1: DigiKey; Supplier Part Number 1: 535-9071-1-ND; Type: MHz Crystal; Value: 16 MHz
Y2 = ABM8G-24.000MHZ-4Y-T3: CRYSTAL 24.0000MHZ 10PF SMD; Manufacturer: Abracon LLC; ESR (Equivalent Series Resistance): 60 Ohms; Frequency Stability: ±30ppm; Operating Mode: Fundamental; Part Number: ABM8G-24.000MHZ-4Y-T3; ComponentLink1Description: Datasheet; ComponentLink1URL: https://abracon.com/Resonators/ABM8G.pdf; ComponentLink2Description: DigiKey Link; ComponentLink2URL: http://digikey.com/product-detail/en/abracon-llc/ABM8G-24.000MHZ-4Y-T3/535-10913-1-ND/2624246; Device Package: 4-SMD, No Lead; Frequency: 24MHz; Frequency Tolerance: ±30ppm; Height - Seated (Max): 0.039" (1.00mm); LastUpdated: 3/19/2020 10:36:25 PM; Lifecycle Status: Active; Load Capacitance: 10pF; Minimum Order: 1; Mounting Type: Surface Mount; Operating Temperature: -10°C ~ 60°C; Package / Case: 4-SMD, No Lead; Packaging: TapeAndReel; PartId: 361; Part Status: Active; Price: 0.39; Series: ABM8G; Size / Dimension: 0.126" L x 0.098" W (3.20mm x 2.50mm); Supplier 1: DigiKey; Supplier Part Number 1: 535-10913-1-ND; Type: MHz Crystal; Value: 24MHz